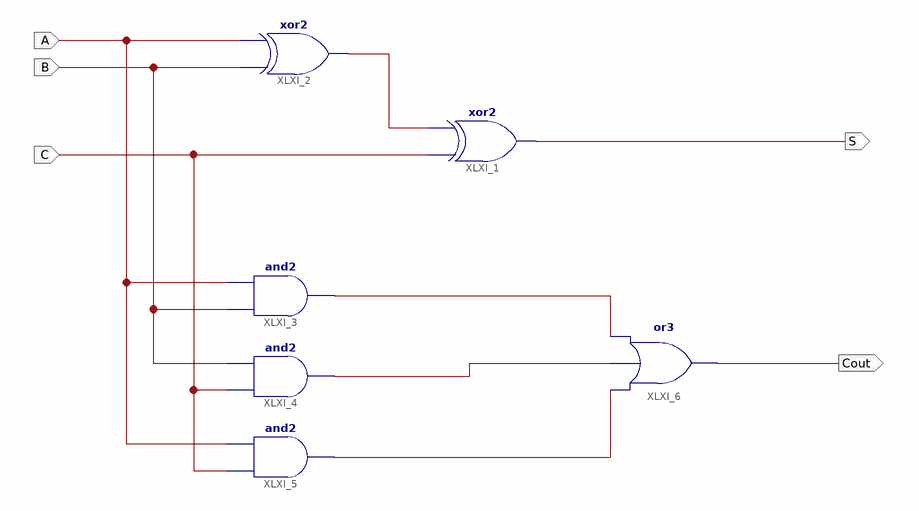
[diagram p0: schematic sheet 1]
// Xilinx ISE schematic Adder1b.sch (artix7) as structural Verilog: 6 symbols, 5 ports
module Adder1b (
  input  C,
  input  A,
  input  B,
  output Cout,
  output S
);

  wire XLXN_1, XLXN_2, XLXN_3, XLXN_6;

  xor XLXI_1 (S, C, XLXN_6);
  xor XLXI_2 (XLXN_6, B, A);
  and XLXI_3 (XLXN_1, B, A);
  and XLXI_4 (XLXN_2, C, B);
  and XLXI_5 (XLXN_3, C, A);
  or XLXI_6 (Cout, XLXN_3, XLXN_2, XLXN_1);
endmodule
